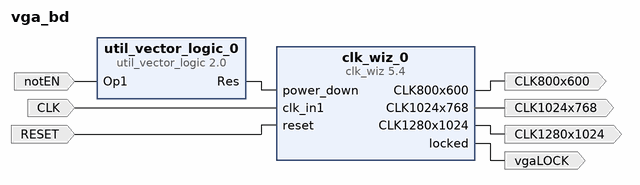
[diagram p0: block diagram of the top level]
# Vivado block design vga_bd, xc7a35tcpg236-1, Vivado 2017.1
create_bd_design vga_bd

create_bd_port -dir I -type rst RESET
set_property -dict {CONFIG.POLARITY ACTIVE_HIGH} [get_bd_ports RESET]
create_bd_port -dir I -type clk CLK
create_bd_port -dir I notEN
create_bd_port -dir O -type clk CLK1280x1024
create_bd_port -dir O -type clk CLK1024x768
create_bd_port -dir O -type clk CLK800x600
create_bd_port -dir O vgaLOCK

create_bd_cell -type ip -vlnv xilinx.com:ip:clk_wiz:5.4 clk_wiz_0
set_property -dict [list \
  CONFIG.CLKOUT2_USED true \
  CONFIG.CLKOUT3_USED true \
  CONFIG.CLKOUT4_USED false \
  CONFIG.CLKOUT5_USED false \
  CONFIG.NUM_OUT_CLKS 3 \
  CONFIG.CLK_OUT1_PORT CLK1280x1024 \
  CONFIG.CLK_OUT2_PORT CLK1024x768 \
  CONFIG.CLK_OUT3_PORT CLK800x600 \
  CONFIG.CLK_OUT4_PORT CLK640x480 \
  CONFIG.CLKOUT1_REQUESTED_OUT_FREQ 108.000 \
  CONFIG.CLKOUT1_REQUESTED_PHASE 45.000 \
  CONFIG.CLKOUT2_REQUESTED_OUT_FREQ 65.000 \
  CONFIG.CLKOUT2_REQUESTED_PHASE 45.000 \
  CONFIG.CLKOUT3_REQUESTED_OUT_FREQ 40.000 \
  CONFIG.CLKOUT3_REQUESTED_PHASE 45.000 \
  CONFIG.CLKOUT4_REQUESTED_OUT_FREQ 25.175 \
  CONFIG.CLKOUT5_REQUESTED_OUT_FREQ 100.000 \
  CONFIG.USE_POWER_DOWN true \
  CONFIG.RESET_PORT reset \
  CONFIG.MMCM_DIVCLK_DIVIDE 6 \
  CONFIG.MMCM_CLKFBOUT_MULT_F 62.375 \
  CONFIG.MMCM_CLKOUT0_DIVIDE_F 9.625 \
  CONFIG.MMCM_CLKOUT1_DIVIDE 16 \
  CONFIG.MMCM_CLKOUT2_DIVIDE 26 \
  CONFIG.MMCM_CLKOUT3_DIVIDE 1 \
  CONFIG.MMCM_CLKOUT4_DIVIDE 1 \
  CONFIG.RESET_TYPE ACTIVE_HIGH \
  CONFIG.CLKOUT1_JITTER 256.807 \
  CONFIG.CLKOUT1_PHASE_ERROR 408.086 \
  CONFIG.CLKOUT2_JITTER 275.099 \
  CONFIG.CLKOUT2_PHASE_ERROR 408.086 \
  CONFIG.CLKOUT3_JITTER 293.873 \
  CONFIG.CLKOUT3_PHASE_ERROR 408.086 \
  CONFIG.CLKOUT4_JITTER 313.553 \
  CONFIG.CLKOUT4_PHASE_ERROR 408.086 \
  CONFIG.CLKOUT5_JITTER 193.459 \
  CONFIG.CLKOUT5_PHASE_ERROR 306.323 \
] [get_bd_cells clk_wiz_0]
create_bd_cell -type ip -vlnv xilinx.com:ip:util_vector_logic:2.0 util_vector_logic_0
set_property -dict {CONFIG.C_SIZE 1 CONFIG.C_OPERATION not} [get_bd_cells util_vector_logic_0]

# ---- connections ----

connect_bd_net -net clk_in1_1 [get_bd_ports CLK] [get_bd_pins clk_wiz_0/clk_in1]
connect_bd_net [get_bd_pins clk_wiz_0/CLK1280x1024] [get_bd_ports CLK1280x1024]
connect_bd_net [get_bd_pins clk_wiz_0/CLK1024x768] [get_bd_ports CLK1024x768]
connect_bd_net [get_bd_pins clk_wiz_0/CLK800x600] [get_bd_ports CLK800x600]
connect_bd_net [get_bd_pins clk_wiz_0/locked] [get_bd_ports vgaLOCK]
connect_bd_net [get_bd_ports RESET] [get_bd_pins clk_wiz_0/reset]
connect_bd_net [get_bd_ports notEN] [get_bd_pins util_vector_logic_0/Op1]
connect_bd_net [get_bd_pins util_vector_logic_0/Res] [get_bd_pins clk_wiz_0/power_down]

validate_bd_design
save_bd_design
